# Altium schematic sheet NANO103.SchDoc
size A3
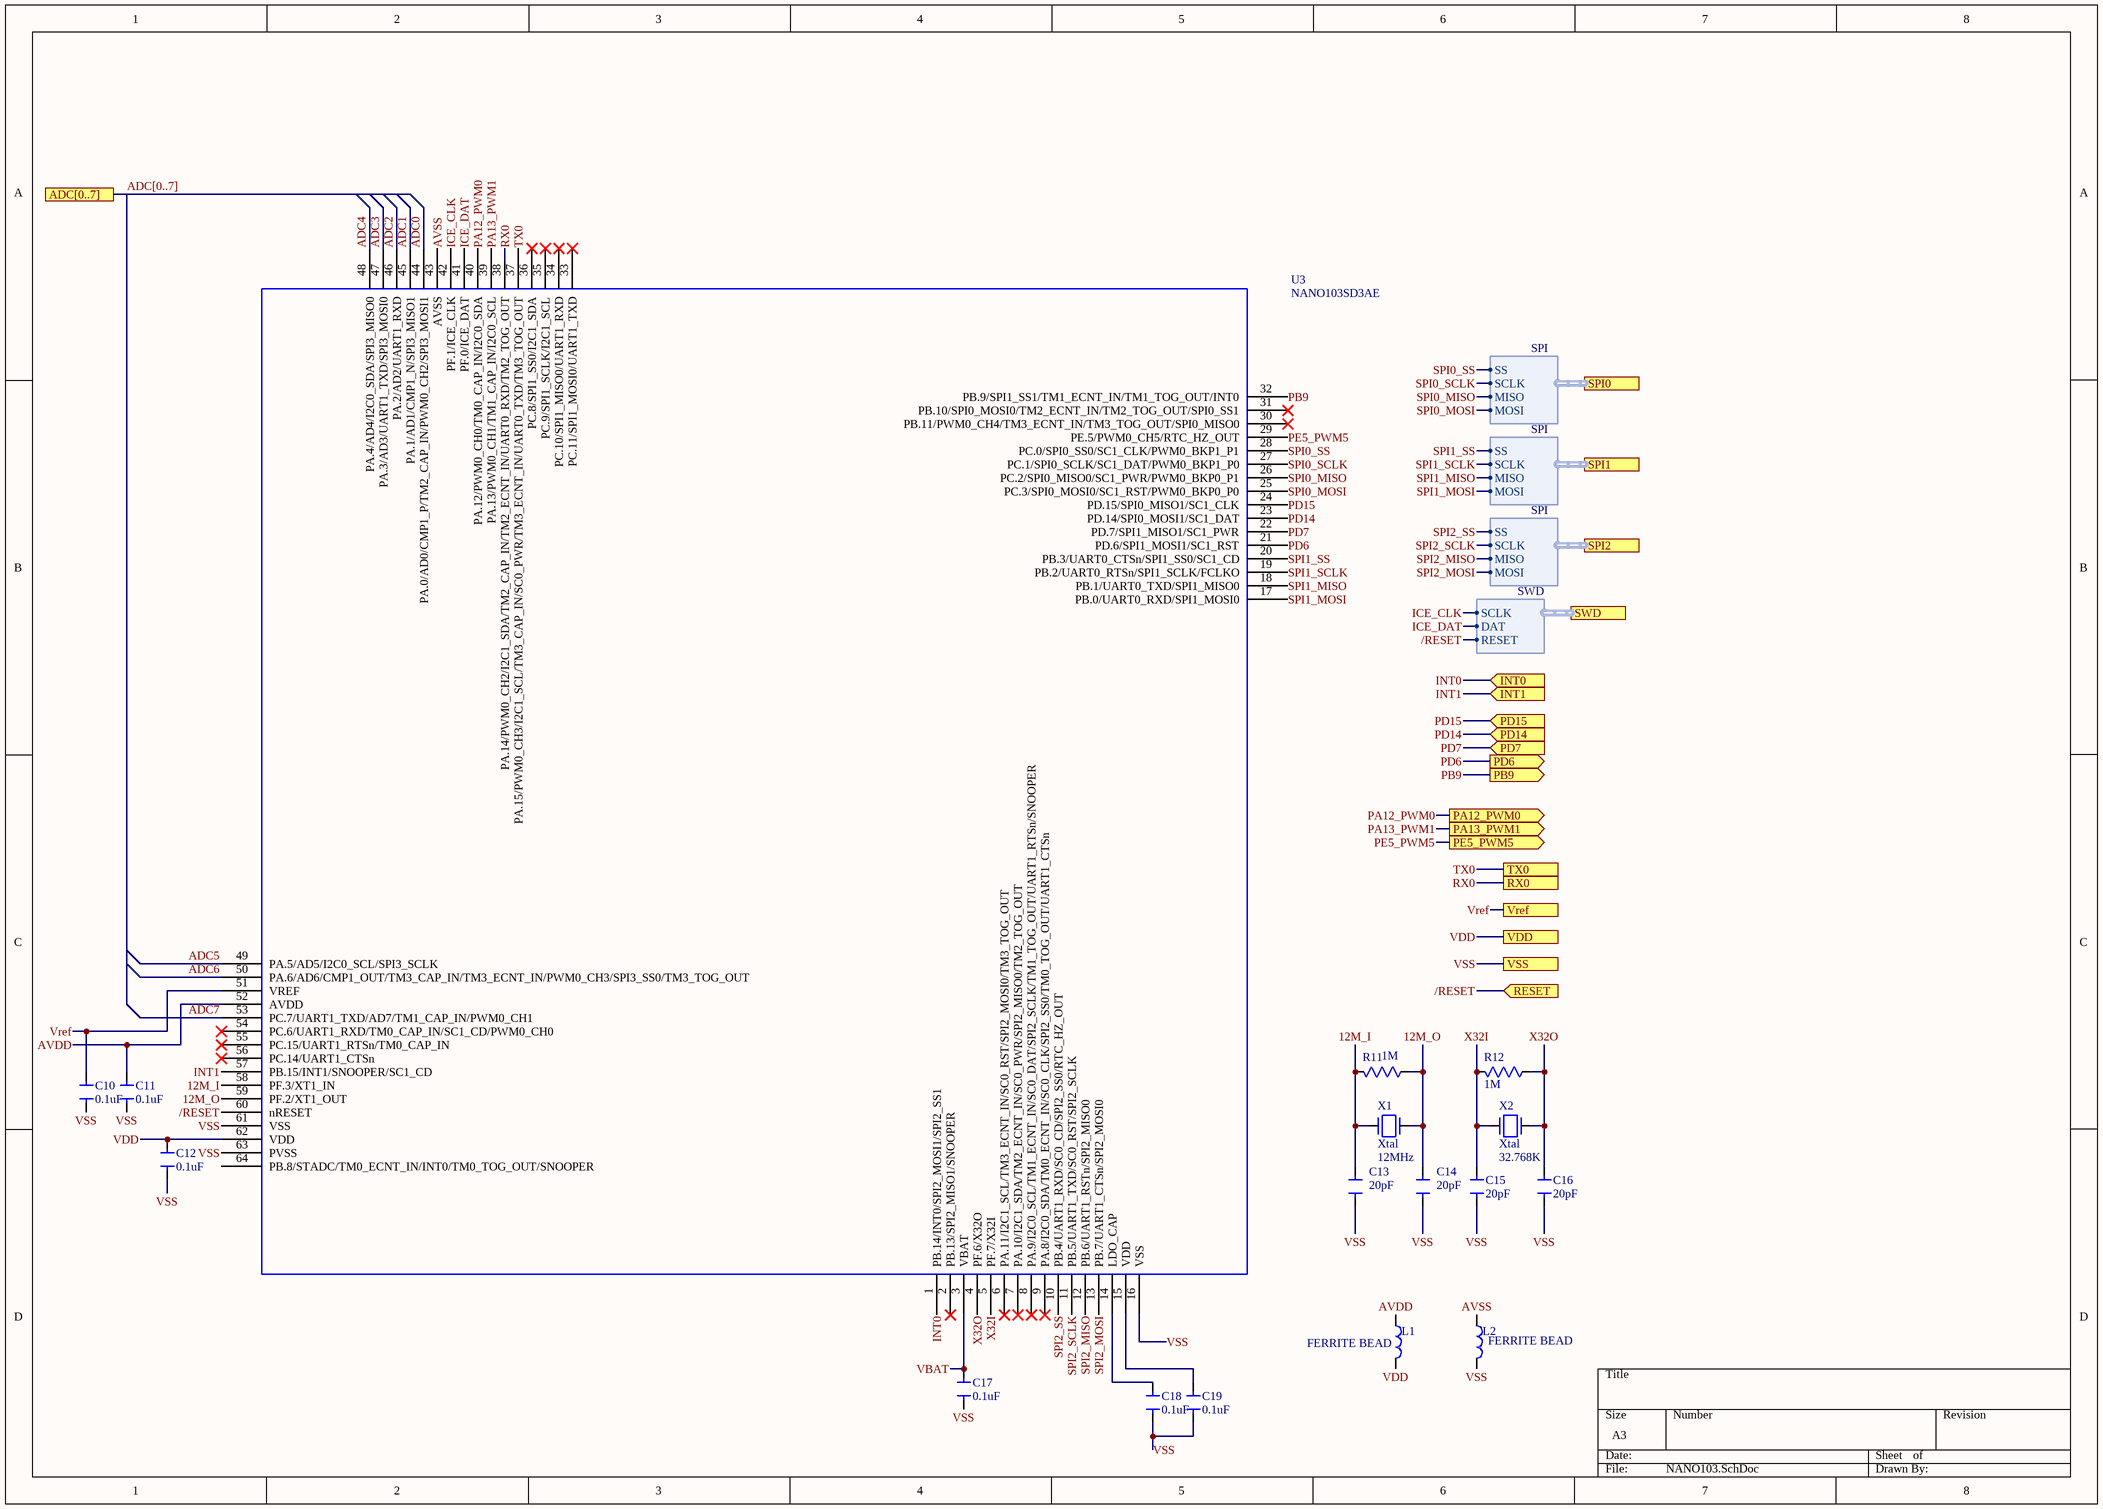
[diagram p0: NANO103.SchDoc]

## Parts
C10  value 0.1uF  [CAP_0402]  (hidden comment: Cap)
C11  value 0.1uF  [CAP_0402]  (hidden comment: Cap)
C12  value 0.1uF  [CAP_0402]  (hidden comment: Cap)
C13  value 20pF  [CAP_0402]  (hidden comment: Cap)
C14  value 20pF  [CAP_0402]  (hidden comment: Cap)
C15  value 20pF  [CAP_0402]  (hidden comment: Cap)
C16  value 20pF  [CAP_0402]  (hidden comment: Cap)
C17  value 0.1uF  [CAP_0402]  (hidden comment: Cap)
C18  value 0.1uF  [CAP_0402]  (hidden comment: Cap)
C19  value 0.1uF  [CAP_0402]  (hidden comment: Cap)
L1  FERRITE BEAD  [Inductor_0603]
L2  FERRITE BEAD  [Inductor_0603]
R11  value 1M  [RES_0402]  (hidden comment: Res)
R12  value 1M  [RES_0402]  (hidden comment: Res)
U3  NANO103SD3AE  [MCU_LQFP_64_7x7]
X1  Xtal  value 12MHz  [2520S]
X2  Xtal  value 32.768K  [FC-135]

## Ports
ADC[0..7], INT0 (in), INT1 (in), PA12_PWM0 (out), PA13_PWM1 (out), PB9 (out), PD6 (out), PD7 (in), PD14 (in), PD15 (in), PE5_PWM5 (out), RESET (in), RX0, SPI0 (harness SPI), SPI1 (harness SPI), SPI2 (harness SPI), SWD (harness SWD), TX0, VDD, Vref, VSS

## Harnesses
SPI: SS, MISO, MOSI, SCLK
SWD: DAT, RESET, SCLK

## Nets
12M_I: C13.1 R11.1 U3.58(PF.3/XT1_IN) X1.2
12M_O: C14.1 R11.2 U3.59(PF.2/XT1_OUT) X1.1
/RESET: U3.60(nRESET) ; port RESET, port SWD.RESET
ADC0: U3.44(PA.0/AD0/CMP1_P/TM2_CAP_IN/PWM0_CH2/SPI3_MOSI1)
ADC1: U3.45(PA.1/AD1/CMP1_N/SPI3_MISO1)
ADC2: U3.46(PA.2/AD2/UART1_RXD)
ADC3: U3.47(PA.3/AD3/UART1_TXD/SPI3_MOSI0)
ADC4: U3.48(PA.4/AD4/I2C0_SDA/SPI3_MISO0)
ADC5: U3.49(PA.5/AD5/I2C0_SCL/SPI3_SCLK)
ADC6: U3.50(PA.6/AD6/CMP1_OUT/TM3_CAP_IN/TM3_ECNT_IN/PWM0_CH3/SPI3_SS0/TM3_TOG_OUT)
ADC7: U3.53(PC.7/UART1_TXD/AD7/TM1_CAP_IN/PWM0_CH1)
AVDD: C11.2 L1.1 U3.52(AVDD)
AVSS: L2.1 U3.43(AVSS)
ICE_CLK: U3.42(PF.1/ICE_CLK) ; port SWD.SCLK
ICE_DAT: U3.41(PF.0/ICE_DAT) ; port SWD.DAT
INT0: U3.1(PB.14/INT0/SPI2_MOSI1/SPI2_SS1) ; port INT0
INT1: U3.57(PB.15/INT1/SNOOPER/SC1_CD) ; port INT1
PA12_PWM0: U3.40(PA.12/PWM0_CH0/TM0_CAP_IN/I2C0_SDA) ; port PA12_PWM0
PA13_PWM1: U3.39(PA.13/PWM0_CH1/TM1_CAP_IN/I2C0_SCL) ; port PA13_PWM1
PB9: U3.32(PB.9/SPI1_SS1/TM1_ECNT_IN/TM1_TOG_OUT/INT0) ; port PB9
PD6: U3.21(PD.6/SPI1_MOSI1/SC1_RST) ; port PD6
PD7: U3.22(PD.7/SPI1_MISO1/SC1_PWR) ; port PD7
PD14: U3.23(PD.14/SPI0_MOSI1/SC1_DAT) ; port PD14
PD15: U3.24(PD.15/SPI0_MISO1/SC1_CLK) ; port PD15
PE5_PWM5: U3.29(PE.5/PWM0_CH5/RTC_HZ_OUT) ; port PE5_PWM5
RX0: U3.38(PA.14/PWM0_CH2/I2C1_SDA/TM2_CAP_IN/TM2_ECNT_IN/UART0_RXD/TM2_TOG_OUT) ; port RX0
SPI0_MISO: U3.26(PC.2/SPI0_MISO0/SC1_PWR/PWM0_BKP0_P1) ; port SPI0.MISO
SPI0_MOSI: U3.25(PC.3/SPI0_MOSI0/SC1_RST/PWM0_BKP0_P0) ; port SPI0.MOSI
SPI0_SCLK: U3.27(PC.1/SPI0_SCLK/SC1_DAT/PWM0_BKP1_P0) ; port SPI0.SCLK
SPI0_SS: U3.28(PC.0/SPI0_SS0/SC1_CLK/PWM0_BKP1_P1) ; port SPI0.SS
SPI1_MISO: U3.18(PB.1/UART0_TXD/SPI1_MISO0) ; port SPI1.MISO
SPI1_MOSI: U3.17(PB.0/UART0_RXD/SPI1_MOSI0) ; port SPI1.MOSI
SPI1_SCLK: U3.19(PB.2/UART0_RTSn/SPI1_SCLK/FCLKO) ; port SPI1.SCLK
SPI1_SS: U3.20(PB.3/UART0_CTSn/SPI1_SS0/SC1_CD) ; port SPI1.SS
SPI2_MISO: U3.12(PB.6/UART1_RSTn/SPI2_MISO0) ; port SPI2.MISO
SPI2_MOSI: U3.13(PB.7/UART1_CTSn/SPI2_MOSI0) ; port SPI2.MOSI
SPI2_SCLK: U3.11(PB.5/UART1_TXD/SC0_RST/SPI2_SCLK) ; port SPI2.SCLK
SPI2_SS: U3.10(PB.4/UART1_RXD/SC0_CD/SPI2_SS0/RTC_HZ_OUT) ; port SPI2.SS
TX0: U3.37(PA.15/PWM0_CH3/I2C1_SCL/TM3_CAP_IN/SC0_PWR/TM3_ECNT_IN/UART0_TXD/TM3_TOG_OUT) ; port TX0
VBAT: C17.2 U3.3(VBAT)
VDD: C12.2 L1.2 U3.62(VDD) ; port VDD
Vref: C10.2 U3.51(VREF) ; port Vref
VSS: C10.1 C11.1 C12.1 C13.2 C14.2 C15.2 C16.2 C17.1 C18.1 C19.1 L2.2 U3.16(VSS) U3.61(VSS) U3.63(PVSS) ; port VSS
X32I: C15.1 R12.1 U3.5(PF.7/X32I) X2.2
X32O: C16.1 R12.2 U3.4(PF.6/X32O) X2.1
NetC18_2: C18.2 U3.14(LDO_CAP)
NetC19_2: C19.2 U3.15(VDD)

Not connected (* = marked no-connect by the designer): U3 2(PB.13/SPI2_MISO1/SNOOPER)* 6(PA.11/I2C1_SCL/TM3_ECNT_IN/SC0_RST/SPI2_MOSI0/TM3_TOG_OUT)* 7(PA.10/I2C1_SDA/TM2_ECNT_IN/SC0_PWR/SPI2_MISO0/TM2_TOG_OUT)* 8(PA.9/I2C0_SCL/TM1_ECNT_IN/SC0_DAT/SPI2_SCLK/TM1_TOG_OUT/UART1_RTSn/SNOOPER)* 9(PA.8/I2C0_SDA/TM0_ECNT_IN/SC0_CLK/SPI2_SS0/TM0_TOG_OUT/UART1_CTSn)* 30(PB.11/PWM0_CH4/TM3_ECNT_IN/TM3_TOG_OUT/SPI0_MISO0)* 31(PB.10/SPI0_MOSI0/TM2_ECNT_IN/TM2_TOG_OUT/SPI0_SS1)* 33(PC.11/SPI1_MOSI0/UART1_TXD)* 34(PC.10/SPI1_MISO0/UART1_RXD)* 35(PC.9/SPI1_SCLK/I2C1_SCL)* 36(PC.8/SPI1_SS0/I2C1_SDA)* 54(PC.6/UART1_RXD/TM0_CAP_IN/SC1_CD/PWM0_CH0)* 55(PC.15/UART1_RTSn/TM0_CAP_IN)* 56(PC.14/UART1_CTSn)* 64(PB.8/STADC/TM0_ECNT_IN/INT0/TM0_TOG_OUT/SNOOPER)

## Buses and harness runs
bus ADC[0..7] = port ADC[0..7]

## Library data of the parts
L1 L2 = Inductor
U3 = NANO103SD3AE: OriginalSymbolOrigin: (0,0)